# Altium schematic sheet Ports.SchDoc
size A; SheetNumber: 3; SheetTotal: 3
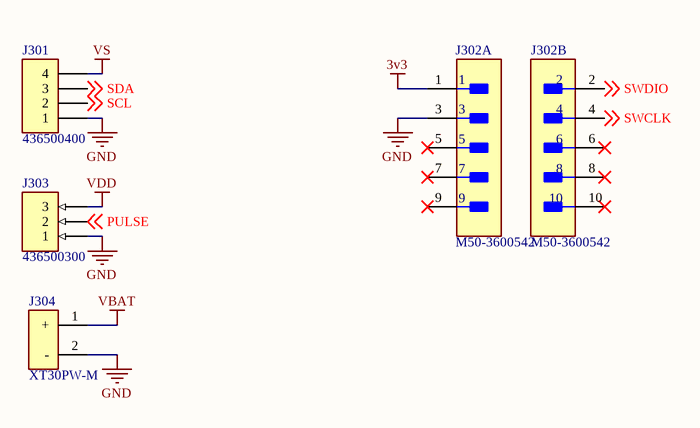
[diagram p0: Ports.SchDoc]

## Parts
J301  436500400  [436500400]
J302  M50-3600542  [FP-M50-3600542-MFG]  (parts A,B of 2)
J303  436500300  [436500300]
J304  XT30PW-M  [XT30PW-M]

## Nets
3v3: J302.1
GND: J301.1 J302.3 J303.1 J304.2(-)
VBAT: J304.1(+)
VDD: J303.3
VS: J301.4
PULSE: J303.2 ; off-sheet PULSE
SCL: J301.2 ; off-sheet SCL
SDA: J301.3 ; off-sheet SDA
SWCLK: J302.4 ; off-sheet SWCLK
SWDIO: J302.2 ; off-sheet SWDIO

Not connected (* = marked no-connect by the designer): J302 5* 6* 7* 8* 9* 10*

## Library data of the parts
J302 = M50-3600542: CONN HEADER SMD 10POS 1.27MM; Gender: Male; Insulation Resistance: 5GR; Row Spacing: 0.05inch; Number of Contacts: 10; Current Rating: 1A; Contact Resistance: 30mR; Length: 6.35mm; Mount: Surface Mount; Radiation Hardening: No; Contact Material: Copper Alloy; Material: Thermoplastic; Package Quantity: 1000; Contact Plating: Gold; Depth: 3.41mm; Contact Mating Length: 0.118inch; Number of Rows: 2; Pitch: 1.27mm; Packaging: Tray; Termination: Solder; Number of Positions: 10; Max Current Rating: 1A; Insulation Material: Thermoplastic; REACH SVHC: No SVHC; Min Operating Temperature: -40°C; Color: Black; Housing Material: Thermoplastic; Max Operating Temperature: 105°C; Orientation: Straight; Supplier 1: Digi-Key; Supplier Part Number 1: 952-1389-ND
J301 = 436500400: Supplier 1: Digi-Key; Supplier Part Number 1: WM1862-ND
J303 = 436500300: Supplier 1: Digi-Key; Supplier Part Number 1: WM1861-ND